# Altium schematic sheet receive.SchDoc
size A4; SheetNumber: 4; SheetTotal: 5
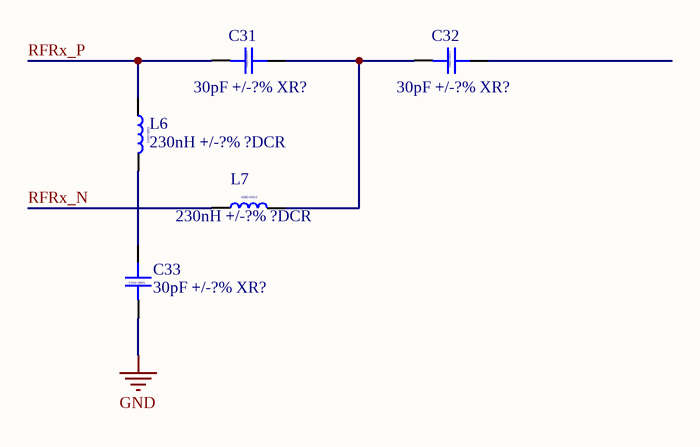
[diagram p0: receive.SchDoc]

## Parts
C31  30pF +/-?% XR?  [CAP_0603]
C32  30pF +/-?% XR?  [CAP_0603]
C33  30pF +/-?% XR?  [CAP_0603]
L6  230nH +/-?% ?DCR  [IND_0603]
L7  230nH +/-?% ?DCR  [IND_0603]

## Nets
GND: C33.1
RFRx_N: L7.1
RFRx_P: C31.1 L6.1
NetC31_2: C31.2 C32.1 L7.2
NetC33_2: C33.2 L6.2

Not connected (* = marked no-connect by the designer): C32 2

## Notes on the sheet
- (in symbol Capacitor-SMD-0603) SMD 0603
- (in symbol Inductor-SMD-RF-0603) SMD 0603

## Library data of the parts
C31-C33 = Capacitor-SMD-0603: Capacitor SMD 0603 RATED
L6 L7 = Inductor-SMD-RF-0603: Inductor SMD 0603